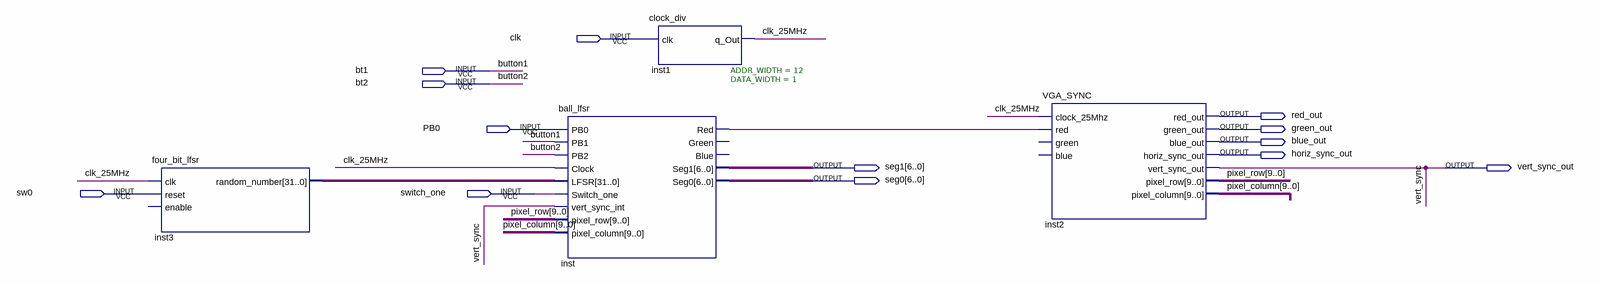
[diagram p0: schematic sheet]
// Quartus schematic Diagram_LFSR.bdf as structural Verilog: 4 symbols, 13 pins
module Diagram_LFSR (
  input  clk,
  input  bt1,
  input  bt2,
  input  PB0,
  input  sw0,
  input  switch_one,
  output red_out,
  output green_out,
  output blue_out,
  output horiz_sync_out,
  output [6:0] seg1,
  output vert_sync_out,
  output [6:0] seg0
);

  wire clk_25MHz, inst_red;
  wire [9:0] pixel_column, pixel_row;
  wire [31:0] inst3_random_number;

  four_bit_lfsr inst3 (.clk(clk_25MHz), .reset(sw0), .random_number(inst3_random_number));  // open: enable
  ball_lfsr #(.ADDR_WIDTH(12), .DATA_WIDTH(1)) inst (
    .PB0(PB0), .PB1(bt1), .PB2(bt2), .Clock(clk_25MHz), .LFSR(inst3_random_number), .Switch_one(switch_one),
    .vert_sync_int(vert_sync_out), .pixel_row(pixel_row), .pixel_column(pixel_column), .Red(inst_red),
    .Seg1(seg1), .Seg0(seg0));  // open: Green, Blue
  clock_div inst1 (.clk(clk), .q_Out(clk_25MHz));
  VGA_SYNC inst2 (
    .clock_25Mhz(clk_25MHz), .red(inst_red), .red_out(red_out), .green_out(green_out), .blue_out(blue_out),
    .horiz_sync_out(horiz_sync_out), .vert_sync_out(vert_sync_out), .pixel_row(pixel_row),
    .pixel_column(pixel_column));  // open: green, blue

  // Other names for the same wires on the sheet: button1 = bt1; button2 = bt2; vert_sync = vert_sync_out
endmodule
